# EasyEDA Pro project PCB板文件.epro

# Schematic Schematic1
Create Date: 2025-05-07; Page Name: P1; Project Name: led工程; Schematic Name: Schematic1; Update Date: 2025-05-21; Company: 嘉立创EDA; Page Size: A4; Version: V1.0
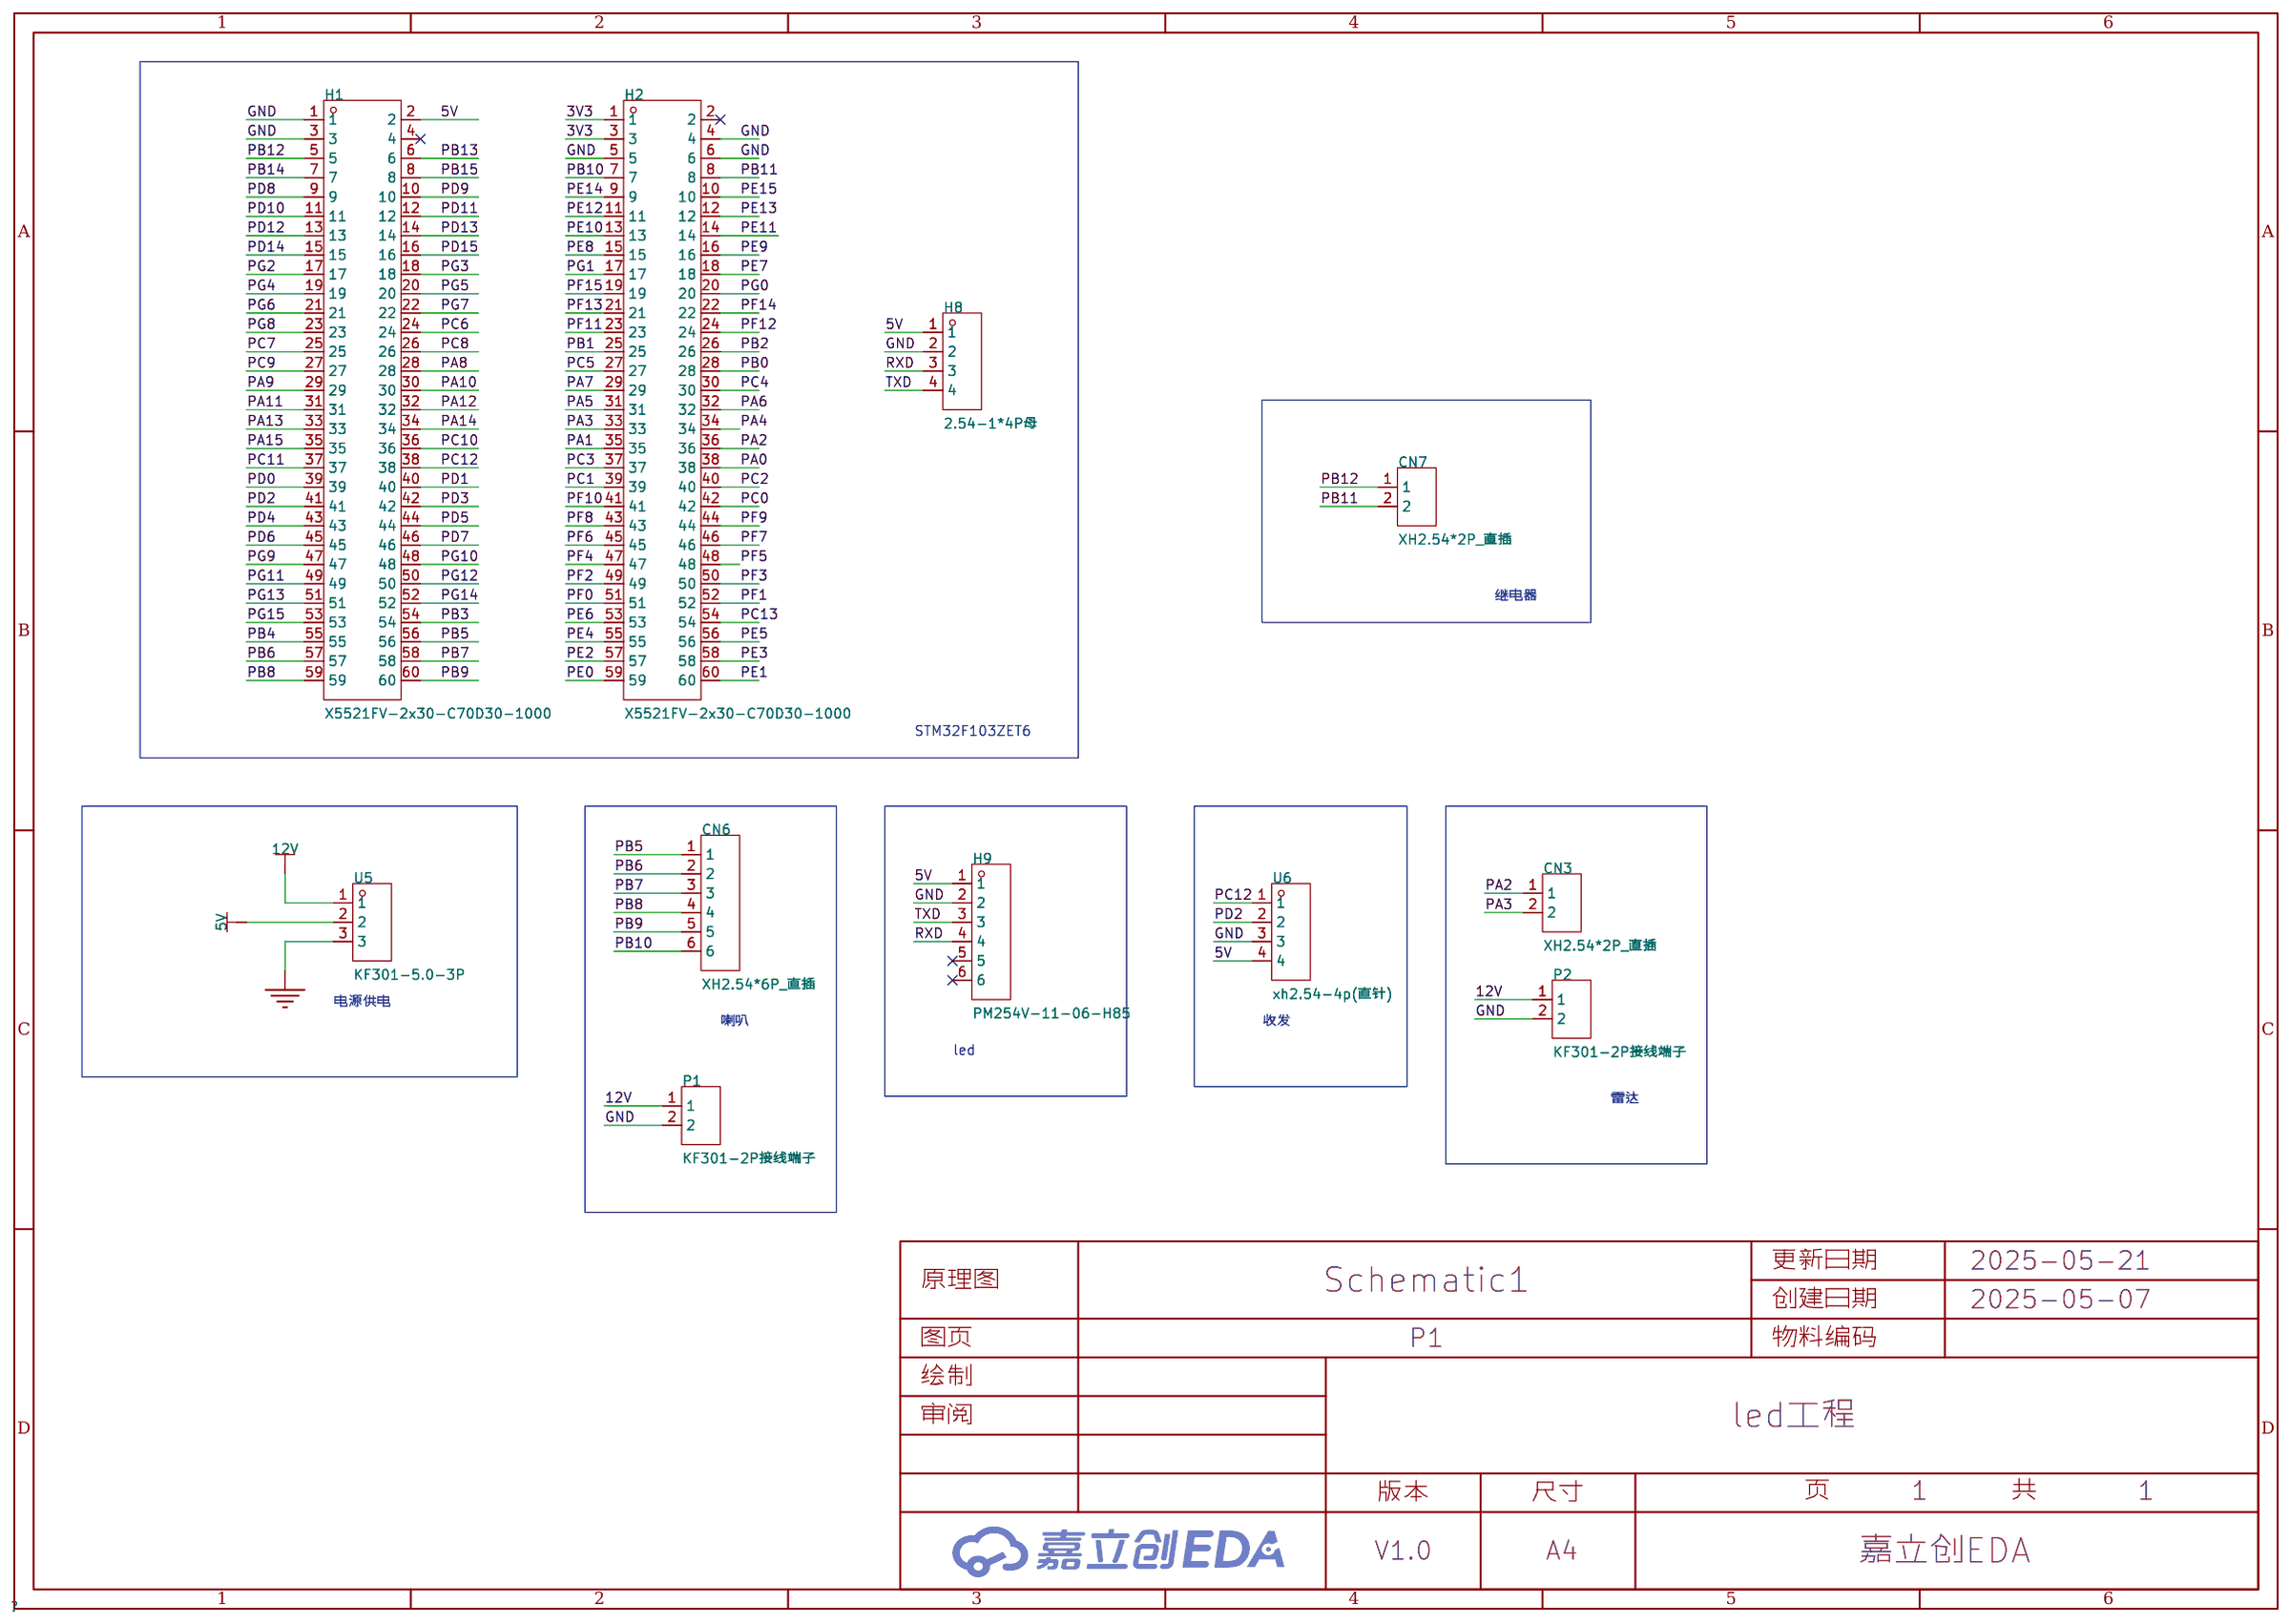
[diagram p0: schematic sheet]

## Parts
CN3  XH2.54*2P_直插  [CONN-TH_2P-P2.50-XH2.54-2P]
CN6  XH2.54*6P_直插  [CONN-TH_XH2.54-6P]
CN7  XH2.54*2P_直插  [CONN-TH_2P-P2.50-XH2.54-2P]
H1  X5521FV-2x30-C70D30-1000  [HDR-TH_60P-P2.54-V-F-R2-C30-S2.54-3]
H2  X5521FV-2x30-C70D30-1000  [HDR-TH_60P-P2.54-V-F-R2-C30-S2.54-3]
H8  2.54-1*4P母  [HDR-TH_4P-P2.54-V-F]
H9  PM254V-11-06-H85  [HDR-TH_6P-P2.54-V-F]
P1  KF301-2P接线端子  [CONN-TH_XY301V-A-5.0-2P]
P2  KF301-2P接线端子  [CONN-TH_XY301V-A-5.0-2P]
U5  KF301-5.0-3P  [CONN-TH_3P-P5.00_KF301-5.0-3P]
U6  xh2.54-4p(直针)  [CONN-TH_4P-P2.50-XH2.54-4P]

## Library data of the parts
CN3 CN7 = XH2.54*2P_直插: Supplier Part: C9900008615; Supplier Footprint: XH2.54_2P; JLCPCB Part Class: 扩展库; Supplier: LCSC
CN6 = XH2.54*6P_直插: Supplier Part: C9900008614; Supplier Footprint: XH2.54_6P; JLCPCB Part Class: 扩展库; Supplier: LCSC
H1 H2 = X5521FV-2x30-C70D30-1000: 插孔结构:2x30P;间距:2.54mm;行距:2.54mm;圆孔/方孔:圆孔;安装类型:直插;排数:双排;总孔位数:60P;额定电流:3A;额定电压:-;插孔方向:顶部;塑高:7mm;触头材质:黄铜;触头镀层:金;工作温度范围:-40℃~+105℃;焊接温度(最大值):260℃;; LCSC Part Name: 间距:2.54mm 2x30P 直插; Supplier Part: C2682214; Manufacturer: XKB Connectivity(中国星坤); Supplier Footprint: 插件,P=2.54mm; Datasheet: https://atta.szlcsc.com/upload/public/pdf/source/20210108/C2682197_06F7869BD6CE28D3571C9D5993C38392.pdf; Supplier: LCSC; Holes Structure: 2x30P; Pitch: 2.54mm; Row Spacing: 2.54mm; Circular Hole / Square Hole: 圆孔; Mounting Type: 直插; Number of Rows: 双排; Number of Holes: 60P; Current Rating (Max): 3A; Holes Direction: 顶部; Insulation Height: 7mm; Contact Material: 黄铜; Contact Plating: 金; Operating Temperature Range: -40℃~+105℃; Soldering Temperature(Max): 260℃
H8 = 2.54-1*4P母: 插孔结构:1x4P;间距:2.54mm;行距:-;圆孔/方孔:方孔;安装类型:直插;排数:单排;总孔位数:4P;额定电流:3A;额定电压:-;插孔方向:顶部;塑高:-;触头材质:青铜;触头镀层:-;工作温度范围:-40℃~+105℃;焊接温度(最大值):-;; LCSC Part Name: 间距:2.54mm 1x4P 直插; Supplier Part: C2718488; Manufacturer: BOOMELE(博穆精密); Supplier Footprint: 插件,P=2.54mm; JLCPCB Part Class: 扩展库; Datasheet: https://atta.szlcsc.com/upload/public/pdf/source/20210301/C2718488_F4427B881E42CAA8DDB0B1C12B3A522C.pdf; Supplier: LCSC; Holes Structure: 1x4P; Pitch: 2.54mm; Circular Hole / Square Hole: 方孔; Mounting Type: 直插; Number of Rows: 单排; Number of Holes: 4P; Current Rating (Max): 3A; Holes Direction: 顶部; Contact Material: 青铜; Operating Temperature Range: -40℃~+105℃
H9 = PM254V-11-06-H85: 插孔结构:1x6P;间距:2.54mm;行距:-;圆孔/方孔:方孔;安装类型:直插;排数:单排;总孔位数:6P;额定电流:3A;额定电压:250V;插孔方向:顶部;塑高:-;工作温度范围:-40℃~+105℃;; LCSC Part Name: 间距:2.54mm 1x6P 直插; Supplier Part: C2832269; Manufacturer: XFCN(兴飞); Supplier Footprint: 插件,P=2.54mm; JLCPCB Part Class: 扩展库; Datasheet: https://atta.szlcsc.com/upload/public/pdf/source/20210514/C2832269_B3EC97736B37C2783BDCE3050AA57447.pdf; Supplier: LCSC; Holes Structure: 1x6P; Pitch: 2.54mm; Circular Hole / Square Hole: 方孔; Mounting Type: 直插; Number of Rows: 单排; Number of Holes: 6P; Current Rating (Max): 3A; Voltage Rating (Max): 250V; Holes Direction: 顶部; Operating Temperature Range: -40℃~+105℃
P1 P2 = KF301-2P接线端子: Supplier Part: C9900016950; Supplier Footprint: CK301-2P; JLCPCB Part Class: 扩展库; Supplier: LCSC
U5 = KF301-5.0-3P: 结构:1x3P;间距:5mm;颜色:蓝色;安装方式:直插;额定电流:17A;额定电压:250V;排数:1;线规 - AWG:14~22;线规 - 平方毫米:1.5;每排PIN数:3;工作温度范围:-30℃~+120℃;; LCSC Part Name: 5mm 1x3P 排数:1 每排P数:3 直插; Supplier Part: C474882; Manufacturer: KEFA(科发); Supplier Footprint: 插件,P=5mm; JLCPCB Part Class: 扩展库; Datasheet: https://atta.szlcsc.com/upload/public/pdf/source/20230317/03A5B5FC229D6F9225E8F51DA1A4E80A.pdf; Supplier: LCSC; Structure: 1x3P; Pitch: 5mm; Color: 蓝色; Mounting Style: 直插; Current Rating (Max): 17A; Voltage Rating (Max): 250V; Number of Pins: 3P; Number of Rows: 1; Wire Gauge - AWG: 14~22; Wire Gauge - mm2: 1.5; Number of PINs Per Row: 3; Operating Temperature Range: -30℃~+120℃
U6 = xh2.54-4p(直针): Supplier Part: C9900015350; JLCPCB Part Class: 扩展库; Supplier: LCSC

## Nets
3V3: H2.1 H2.3
5V: H1.2 H8.1 H9.1 U5.2 U6.4
12V: P1.1 P2.1 U5.1
GND: H1.1 H1.3 H2.4 H2.5 H2.6 H8.2 H9.2 P1.2 P2.2 U5.3 U6.3
PA0: H2.38
PA1: H2.35
PA2: CN3.1 H2.36
PA3: CN3.2 H2.33
PA4: H2.34
PA5: H2.31
PA6: H2.32
PA7: H2.29
PA8: H1.28
PA9: H1.29
PA10: H1.30
PA11: H1.31
PA12: H1.32
PA13: H1.33
PA14: H1.34
PA15: H1.35
PB0: H2.28
PB1: H2.25
PB2: H2.26
PB3: H1.54
PB4: H1.55
PB5: CN6.1 H1.56
PB6: CN6.2 H1.57
PB7: CN6.3 H1.58
PB8: CN6.4 H1.59
PB9: CN6.5 H1.60
PB10: CN6.6 H2.7
PB11: CN7.2 H2.8
PB12: CN7.1 H1.5
PB13: H1.6
PB14: H1.7
PB15: H1.8
PC0: H2.42
PC1: H2.39
PC2: H2.40
PC3: H2.37
PC4: H2.30
PC5: H2.27
PC6: H1.24
PC7: H1.25
PC8: H1.26
PC9: H1.27
PC10: H1.36
PC11: H1.37
PC12: H1.38 U6.1
PC13: H2.54
PD0: H1.39
PD1: H1.40
PD2: H1.41 U6.2
PD3: H1.42
PD4: H1.43
PD5: H1.44
PD6: H1.45
PD7: H1.46
PD8: H1.9
PD9: H1.10
PD10: H1.11
PD11: H1.12
PD12: H1.13
PD13: H1.14
PD14: H1.15
PD15: H1.16
PE0: H2.59
PE1: H2.60
PE2: H2.57
PE3: H2.58
PE4: H2.55
PE5: H2.56
PE6: H2.53
PE7: H2.18
PE8: H2.15
PE9: H2.16
PE10: H2.13
PE11: H2.14
PE12: H2.11
PE13: H2.12
PE14: H2.9
PE15: H2.10
PF0: H2.51
PF1: H2.52
PF2: H2.49
PF3: H2.50
PF4: H2.47
PF5: H2.48
PF6: H2.45
PF7: H2.46
PF8: H2.43
PF9: H2.44
PF10: H2.41
PF11: H2.23
PF12: H2.24
PF13: H2.21
PF14: H2.22
PF15: H2.19
PG0: H2.20
PG1: H2.17
PG2: H1.17
PG3: H1.18
PG4: H1.19
PG5: H1.20
PG6: H1.21
PG7: H1.22
PG8: H1.23
PG9: H1.47
PG10: H1.48
PG11: H1.49
PG12: H1.50
PG13: H1.51
PG14: H1.52
PG15: H1.53
RXD: H8.3 H9.4
TXD: H8.4 H9.3

Not connected (* = marked no-connect by the designer): H1 4*; H2 2*; H9 5* 6*

## Notes on the sheet
- 继电器
- STM32F103ZET6
- 电源供电
- 喇叭
- 收发
- led
- 雷达

# Board PCB1
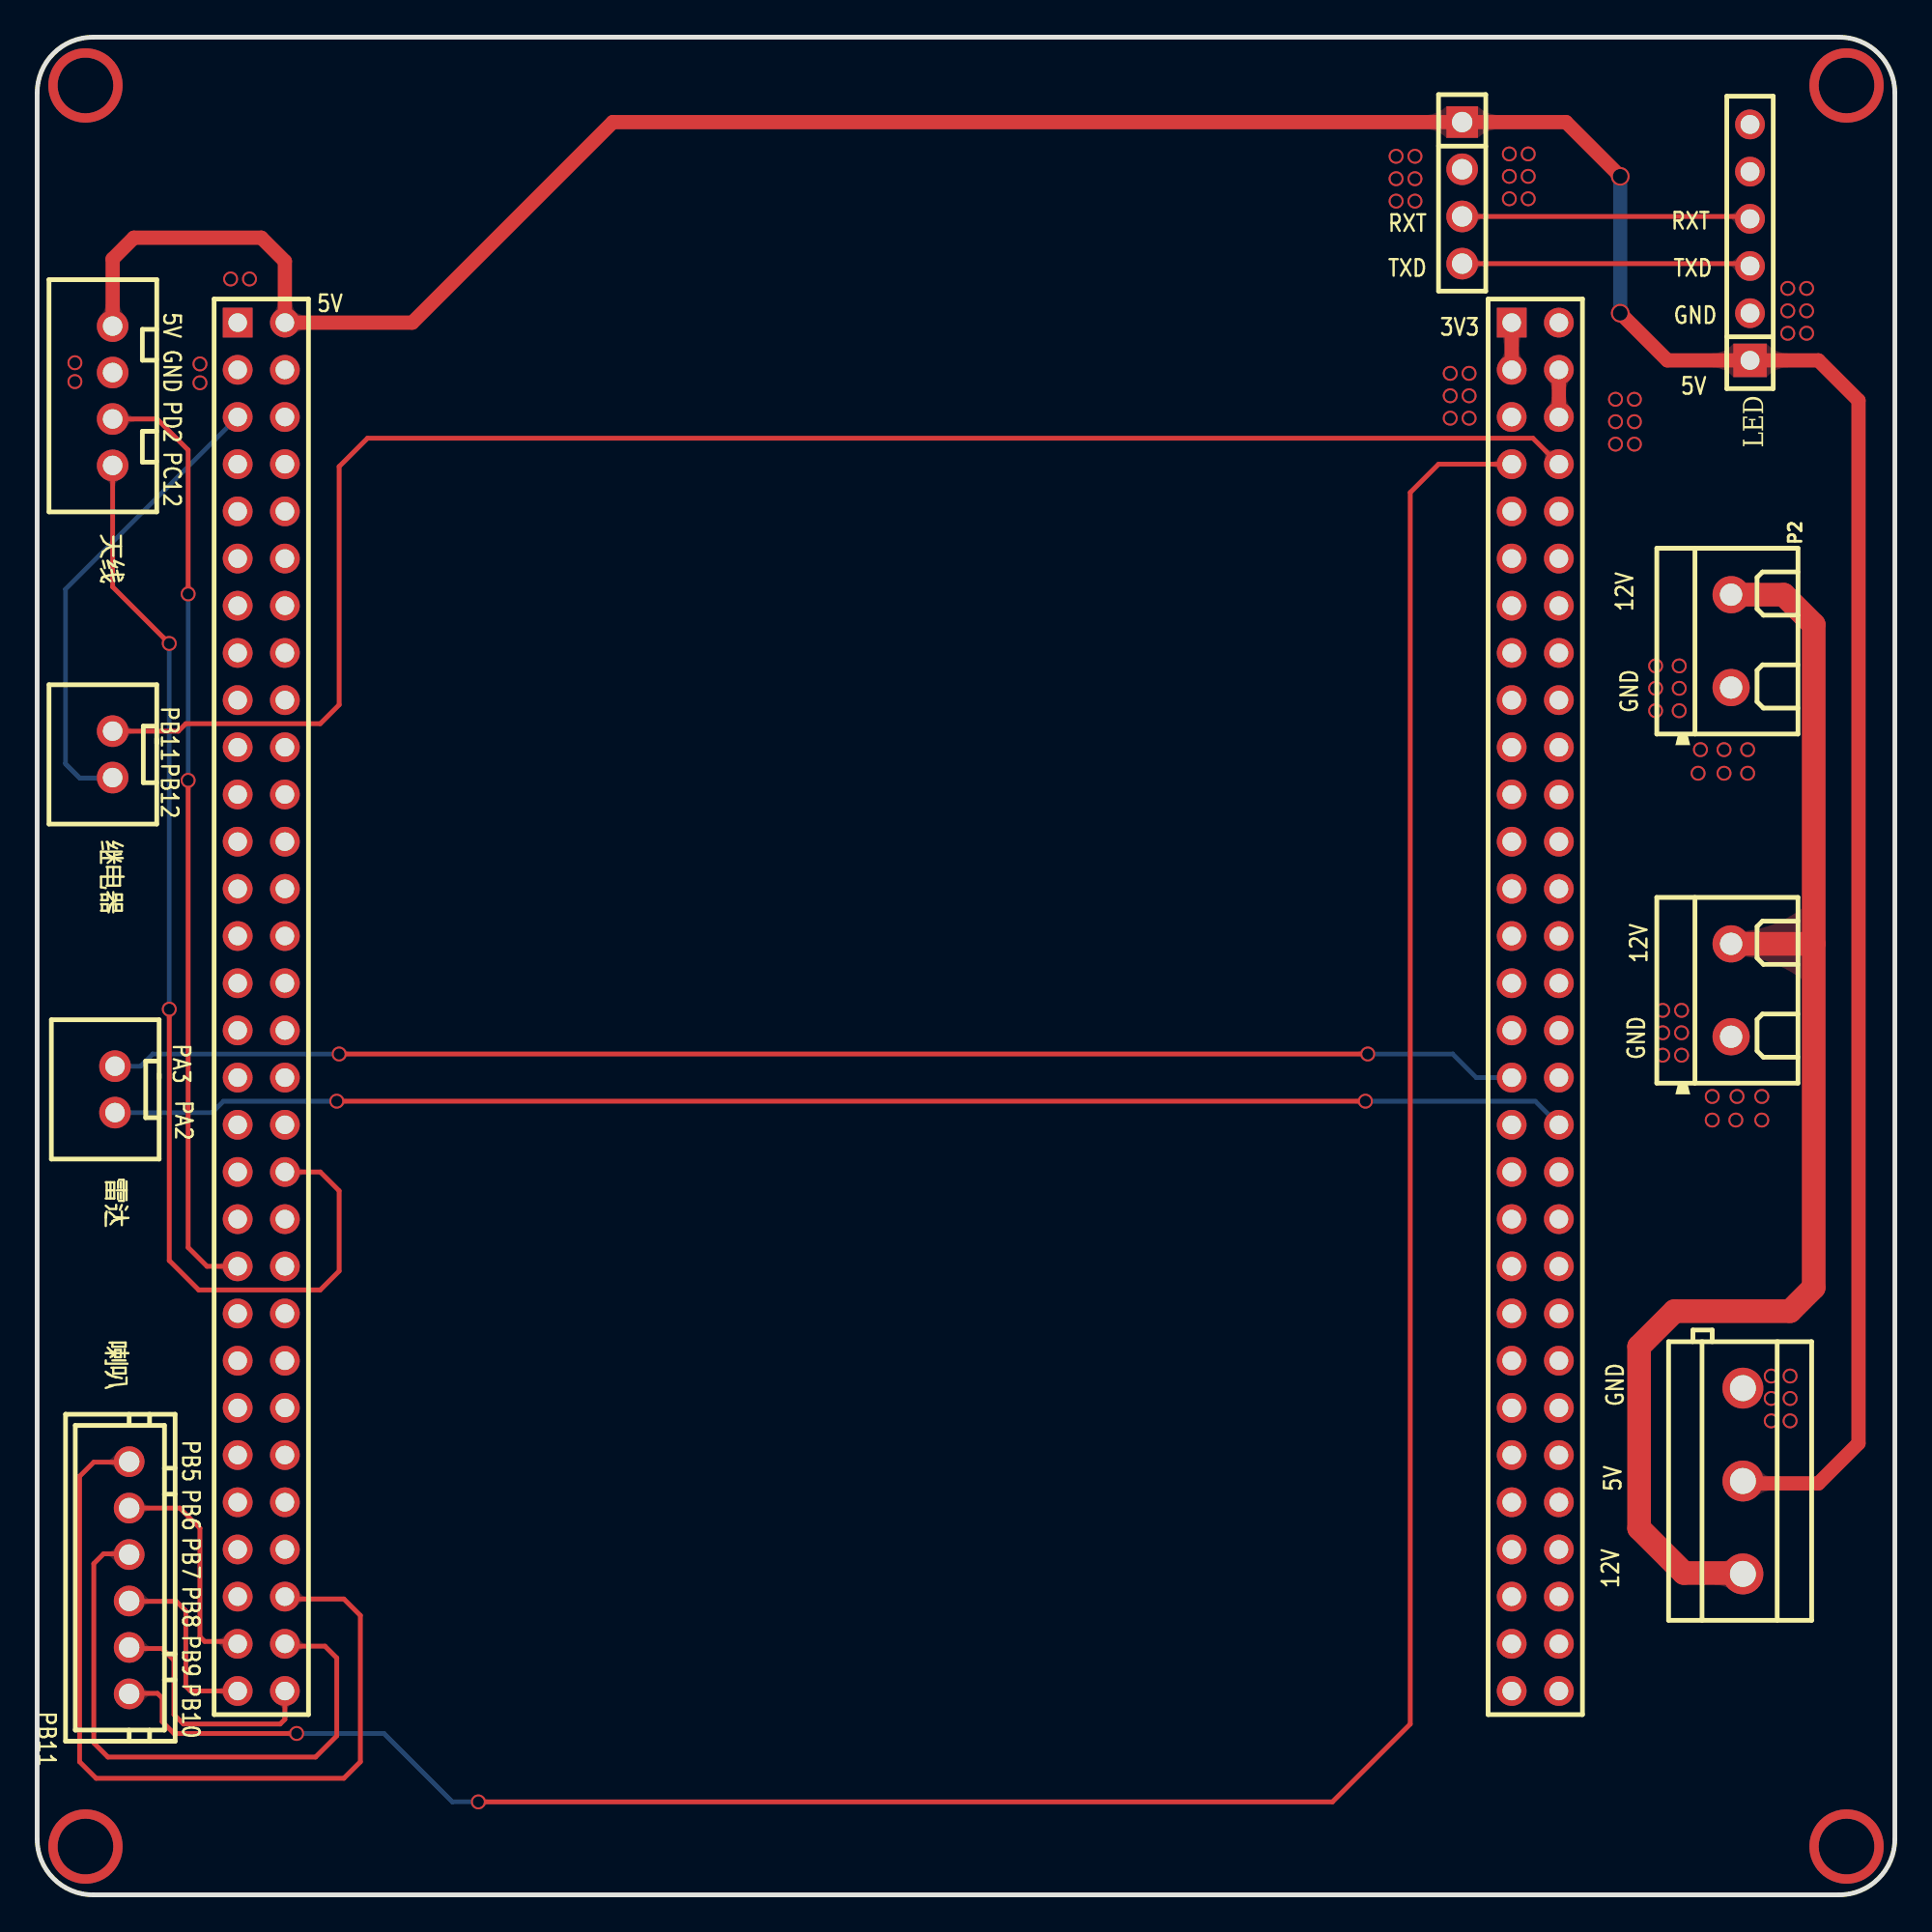
[diagram p1: board, top side]
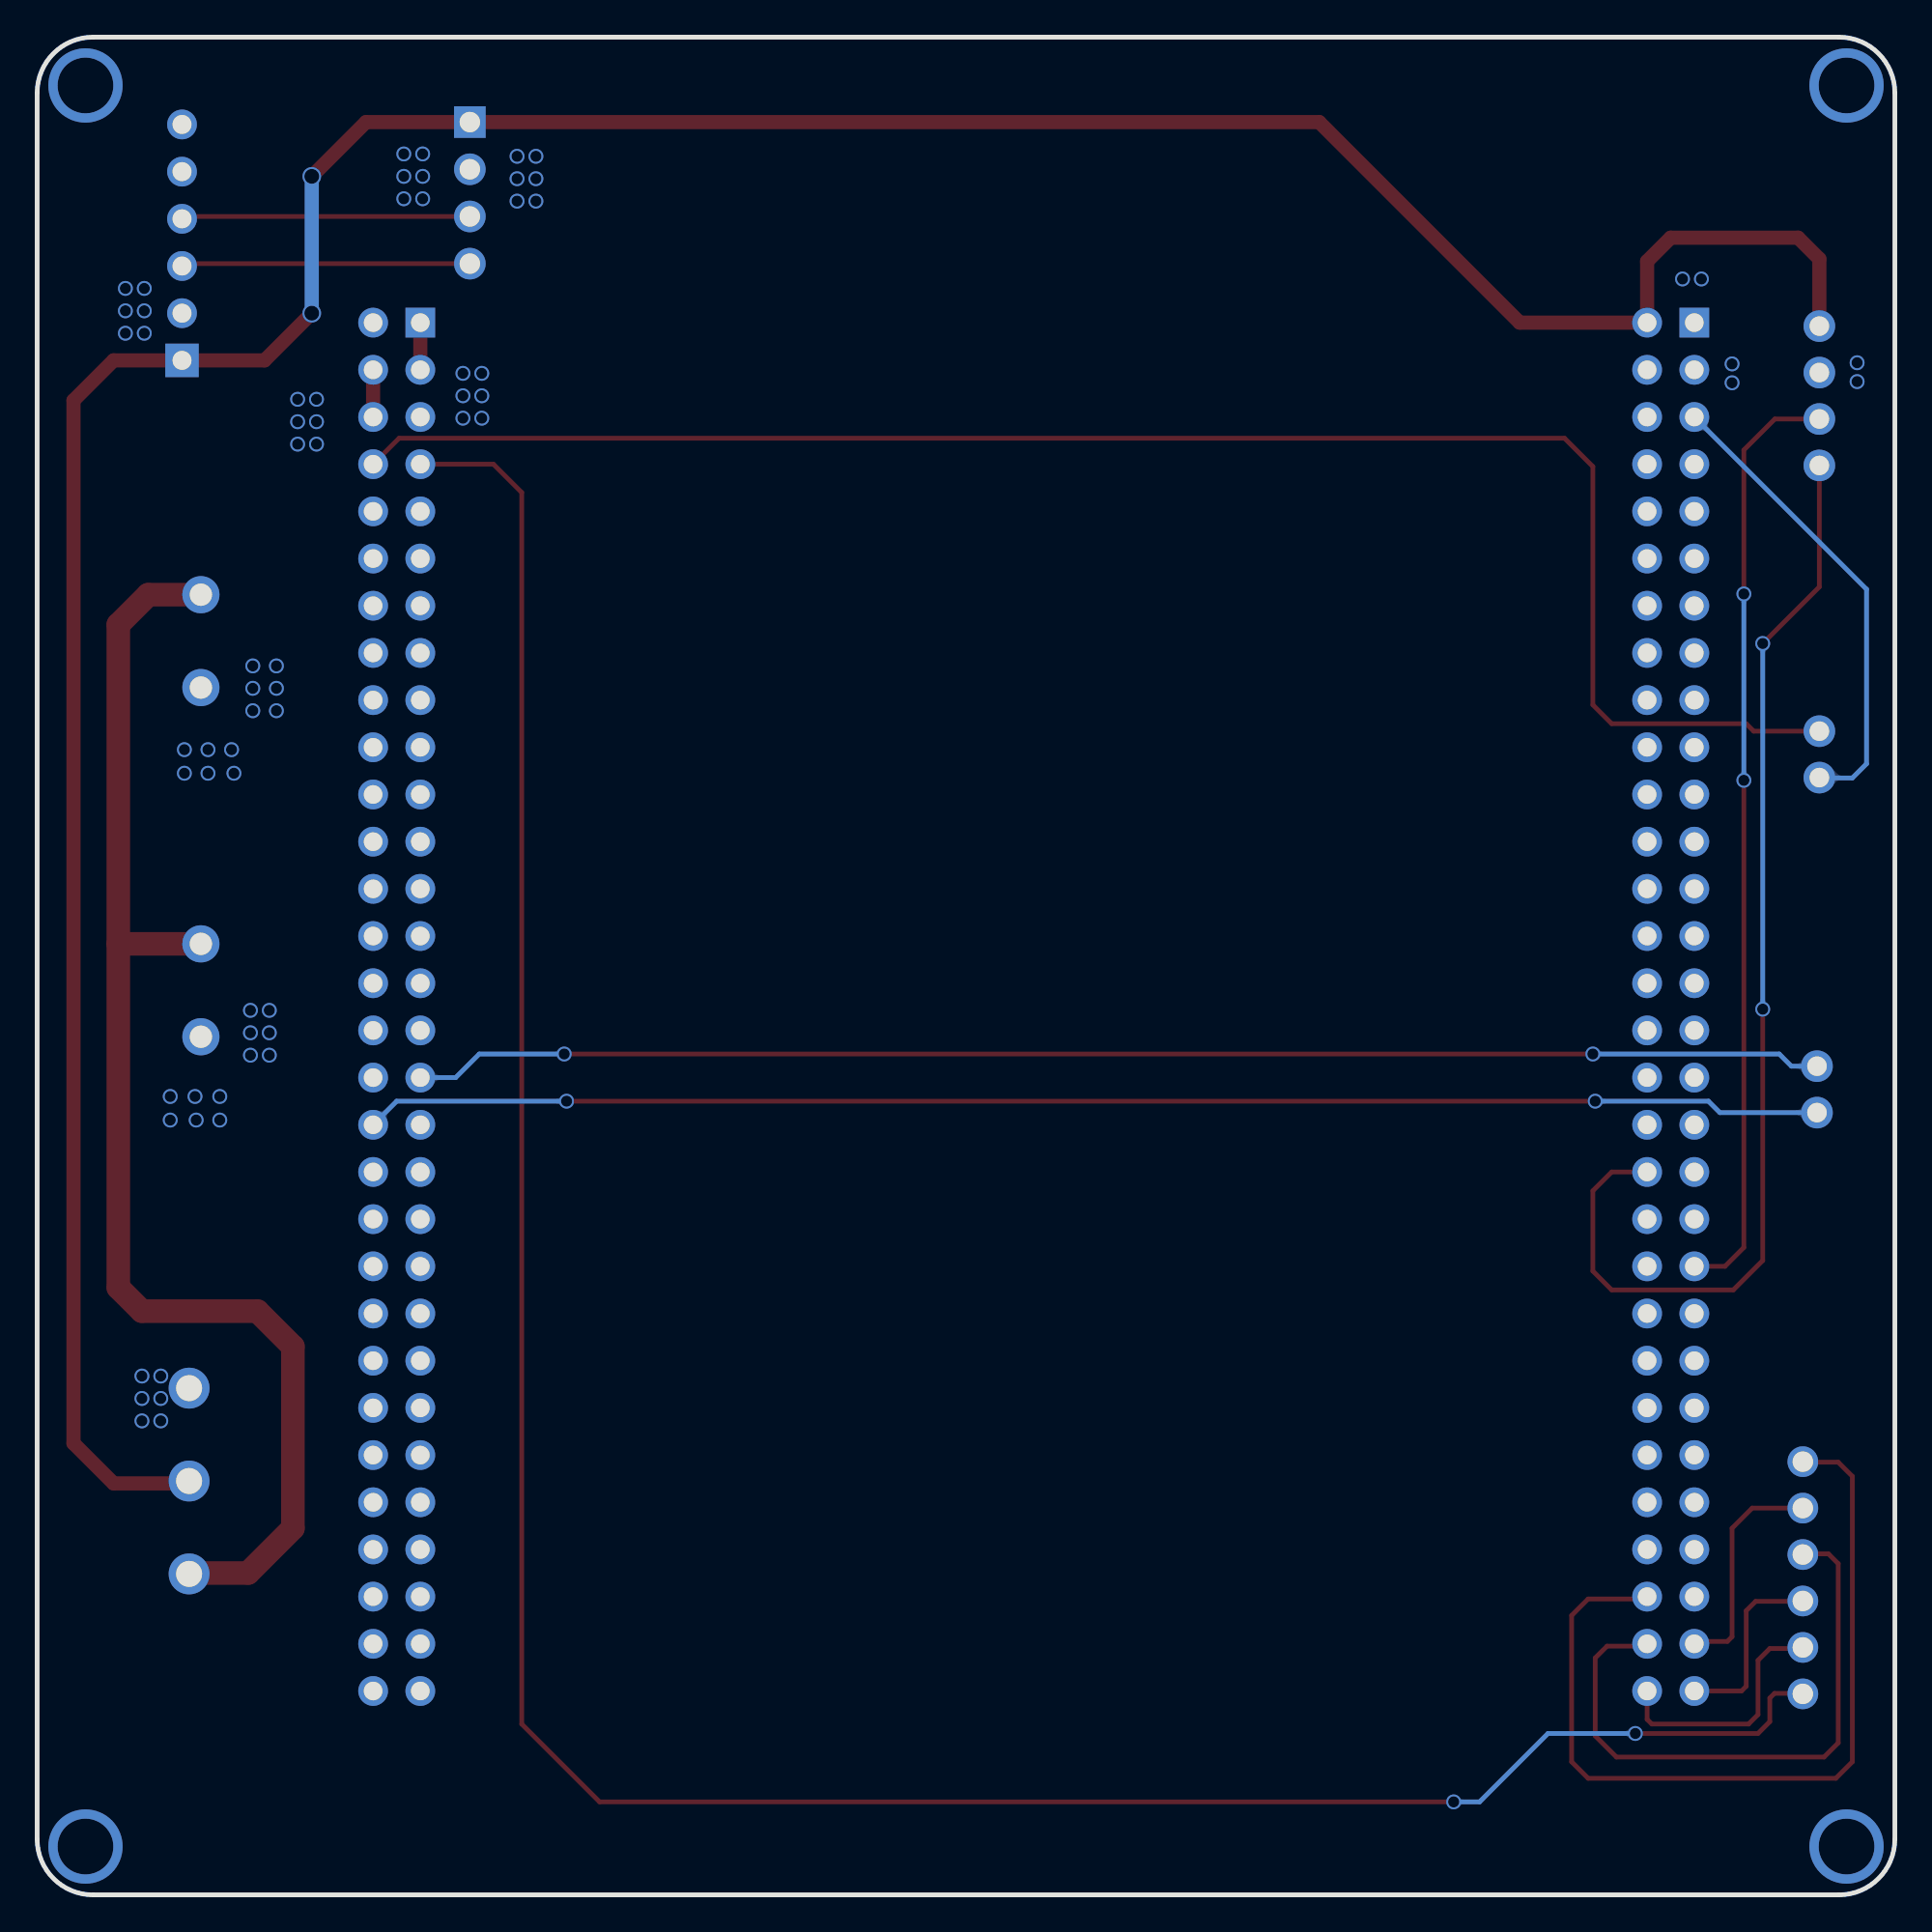
[diagram p2: board, bottom side, seen from below]

Outline 100 x 100 mm; copper layers: Top Layer, Bottom Layer. Coordinates in mm from the lower left corner of the outline.
Outline path: 0,97 0,3 arc(0.88,0.88) 3,0 97,0 arc(99.12,0.88) 100,3 100,97 arc(99.12,99.12) 97,100 3,100 arc(0.88,99.12) 0,97
Stack: Top Layer 0.035mm / Dielectric1 1.51mm FR4 er 4.5 / Bottom Layer 0.035mm

## Design rules (mm)
template: JLCPCB Capability(Two Layers Board)
spacing copperThickness1oz (default): track to track 0.102, other pairs 0.152 to 0.3
spacing copperThickness2oz: track to track 0.203, other pairs 0.152 to 0.3
track width copperThickness1oz (default): min 0.127, default 0.254, max 2.54
track width copperThickness2oz: min 0.203, default 0.254, max 2.54
differential pair differentialPair (default): width min 0.127, default 0.254, max 2.54; gap min 0.152, default 0.152
via viaSize (default): diameter min 0.5, default 0.61, max 10; hole min 0.3, default 0.305, max 6.3

## Placement (name value [footprint] x y rotation side)
CN3  XH2.54*2P_直插  [CONN-TH_2P-P2.50-XH2.54-2P]  4.19 43.36 270 top
CN6  XH2.54*6P_直插  [CONN-TH_XH2.54-6P]  4.95 17.07 270 top
CN7  XH2.54*2P_直插  [CONN-TH_2P-P2.50-XH2.54-2P]  4.06 61.39 270 top
H1  X5521FV-2x30-C70D30-1000  [HDR-TH_60P-P2.54-V-F-R2-C30-S2.54-3]  12.06 47.8 270 top
H2  X5521FV-2x30-C70D30-1000  [HDR-TH_60P-P2.54-V-F-R2-C30-S2.54-3]  80.65 47.8 270 top
H8  2.54-1*4P母  [HDR-TH_4P-P2.54-V-F]  76.71 91.62 270 top
H9  PM254V-11-06-H85  [HDR-TH_6P-P2.54-V-F]  92.2 88.95 90 top
P1  KF301-2P接线端子  [CONN-TH_XY301V-A-5.0-2P]  91.19 48.69 270 top
P2  KF301-2P接线端子  [CONN-TH_XY301V-A-5.0-2P]  91.19 67.49 270 top
U5  KF301-5.0-3P  [CONN-TH_3P-P5.00_KF301-5.0-3P]  91.82 22.28 90 top
U6  xh2.54-4p(直针)  [CONN-TH_4P-P2.50-XH2.54-4P]  4.06 80.7 270 top

## Footprints (pads in the part's own frame, mm; a bottom-side part is the same pattern mirrored in y, then rotated)
CONN-TH_2P-P2.50-XH2.54-2P
  round 1.7 hole 1.05: 1(1.25,0) 2(-1.25,0)
CONN-TH_3P-P5.00_KF301-5.0-3P
  round 2.2 hole 1.4: 1(-5,0) 2(0,0) 3(5,0)
CONN-TH_4P-P2.50-XH2.54-4P
  round 1.7 hole 1.05: 1(3.75,0) 2(1.25,0) 3(-1.25,0) 4(-3.75,0)
CONN-TH_XH2.54-6P
  round 1.65 hole 1.1: 1(-6.25,0) 2(-3.75,0) 3(-1.25,0) 4(1.25,0) 5(3.75,0) 6(6.25,0)
CONN-TH_XY301V-A-5.0-2P
  round 2 hole 1.2: 1(-2.5,0) 2(2.5,0)
HDR-TH_4P-P2.54-V-F
  rect 1.7x1.7 hole 1.1: 1(-3.81,0)
  round 1.7 hole 1.1: 2(-1.27,0) 3(1.27,0) 4(3.81,0)
HDR-TH_6P-P2.54-V-F
  rect 1.8x1.8 hole 1.02: 1(-6.35,0)
  round 1.6 hole 1.02: 2(-3.81,0) 3(-1.27,0) 4(1.27,0) 5(3.81,0) 6(6.35,0)
HDR-TH_60P-P2.54-V-F-R2-C30-S2.54-3
  rect 1.6x1.6 hole 1: 1(-36.83,-1.27)
  round 1.6 hole 1: 2(-36.83,1.27) 3(-34.29,-1.27) 4(-34.29,1.27) 5(-31.75,-1.27) 6(-31.75,1.27) 7(-29.21,-1.27) 8(-29.21,1.27) 9(-26.67,-1.27) 10(-26.67,1.27) 11(-24.13,-1.27) 12(-24.13,1.27) 13(-21.59,-1.27) 14(-21.59,1.27) 15(-19.05,-1.27) 16(-19.05,1.27) 17(-16.51,-1.27) 18(-16.51,1.27) 19(-13.97,-1.27) 20(-13.97,1.27) 21(-11.43,-1.27) 22(-11.43,1.27) 23(-8.89,-1.27) 24(-8.89,1.27) 25(-6.35,-1.27) 26(-6.35,1.27) 27(-3.81,-1.27) 28(-3.81,1.27) 29(-1.27,-1.27) 30(-1.27,1.27) 31(1.27,-1.27) 32(1.27,1.27) 33(3.81,-1.27) 34(3.81,1.27) 35(6.35,-1.27) 36(6.35,1.27) 37(8.89,-1.27) 38(8.89,1.27) 39(11.43,-1.27) 40(11.43,1.27) 41(13.97,-1.27) 42(13.97,1.27) 43(16.51,-1.27) 44(16.51,1.27) 45(19.05,-1.27) 46(19.05,1.27) 47(21.59,-1.27) 48(21.59,1.27) 49(24.13,-1.27) 50(24.13,1.27) 51(26.67,-1.27) 52(26.67,1.27) 53(29.21,-1.27) 54(29.21,1.27) 55(31.75,-1.27) 56(31.75,1.27) 57(34.29,-1.27) 58(34.29,1.27) 59(36.83,-1.27) 60(36.83,1.27)

## Nets
As in the schematic.

Pads without a net: H1 4; H2 2; H9 5 6

## Via types
v1: diameter 4, hole 3, Top Layer to Bottom Layer, 4 vias
v2: diameter 0.8, hole 0.6, Top Layer to Bottom Layer, 76 vias
v3: diameter 1, hole 0.8, Top Layer to Bottom Layer, 2 vias

## Routing (per net, layer and track width the routed paths; a pad name or vN(x,y) marks a point on that pad's centre or on a via; arc(x,y) is an arc through that point)
3V3: length 2.5
  Top Layer w0.762: H2.1 H2.3
5V: length 180.4
  Top Layer w0.762: 91.57,22.15 95.88,22.15 98.04,24.31 98.04,80.44 95.88,82.6 H9.1 87.76,82.6 v3(85.22,85.14) ; U6.4 4.06,88.06 5.21,89.2 12.06,89.2 13.33,87.94 H1.2 20.19,84.63 30.99,95.43 H8.1 82.3,95.43 v3(85.22,92.51)
  Bottom Layer w0.762: v3(85.22,85.14) v3(85.22,92.51)
12V: length 72.1
  Top Layer w1.27: 95.63,51.19 95.63,68.38 94.02,69.99 P2.1 ; 95.63,51.19 P1.1 ; 95.63,51.19 95.63,32.69 94.36,31.42 88.14,31.42 86.23,29.51 86.23,19.74 88.65,17.32 91.39,17.32 91.57,17.15
GND: length 2.5
  Top Layer w0.762: H2.4 H2.6
  vias: v2(2.03,82.47) v2(2.03,81.46) v2(8.76,82.41) v2(8.76,81.39) v2(10.41,86.98) v2(11.43,86.98) v2(73.15,93.59) v2(73.15,92.38) v2(73.15,91.17) v2(74.17,93.59) v2(74.17,92.38) v2(74.17,91.17) v2(76.07,81.9) v2(76.07,80.7) v2(76.07,79.49) v2(77.08,81.9) v2(77.08,80.7) v2(77.08,79.49) v2(79.25,93.71) v2(79.25,92.51) v2(79.25,91.3) v2(80.26,93.71) v2(80.26,92.51) v2(80.26,91.3) v2(84.96,80.51) v2(84.96,79.3) v2(84.96,78.09) v2(85.98,80.51) v2(85.98,79.3) v2(85.98,78.09) v2(87.12,66.15) v2(87.12,64.95) v2(87.12,63.74) v2(87.5,47.61) v2(87.5,46.41) v2(87.5,45.2) v2(88.39,66.15) v2(88.39,64.95) v2(88.39,63.74) v2(88.52,47.61) v2(88.52,46.41) v2(88.52,45.2) v2(89.41,60.38) v2(89.53,61.65) v2(90.17,42.98) v2(90.17,41.71) v2(90.81,61.65) v2(90.81,60.38) v2(91.44,41.71) v2(91.5,42.98) v2(92.07,61.65) v2(92.07,60.38) v2(92.84,42.98) v2(92.84,41.71) v2(93.34,27.93) v2(93.34,26.72) v2(93.34,25.51) v2(94.23,86.47) v2(94.23,85.27) v2(94.23,84.06) v2(94.36,27.93) v2(94.36,26.72) v2(94.36,25.51) v2(95.25,86.47) v2(95.25,85.27) v2(95.25,84.06)
(no net):
  vias: v1(2.6,97.4) v1(2.6,2.6) v1(97.4,97.4) v1(97.4,2.6)
PA2: length 78.5
  Top Layer w0.254: v2(16.13,42.72) v2(71.5,42.72)
  Bottom Layer w0.254: v2(71.5,42.72) 80.65,42.72 H2.36 ; v2(16.13,42.72) 10.03,42.72 9.42,42.11 CN3.1
PA3: length 76
  Top Layer w0.254: v2(16.26,45.26) v2(71.63,45.26)
  Bottom Layer w0.254: CN3.2 5.57,44.61 6.22,45.26 v2(16.26,45.26) ; v2(71.63,45.26) 76.2,45.26 77.47,43.99 H2.33
PB5: length 46.2
  Top Layer w0.254: H1.56 13.46,15.93 16.51,15.93 17.4,15.04 17.4,7.16 16.51,6.27 3.17,6.27 2.29,7.16 2.29,22.53 3.05,23.29 4.6,23.29
PB6: length 12.3
  Top Layer w0.254: CN6.2 7.68,20.82 8.76,19.74 8.76,13.89 9.02,13.64 10.67,13.64 H1.57
PB7: length 32.7
  Top Layer w0.254: 4.7,18.36 3.57,18.36 3.05,17.83 3.05,8.18 3.81,7.42 14.99,7.42 16.13,8.56 16.13,12.75 15.49,13.39 13.46,13.39 H1.58
PB8: length 9.8
  Top Layer w0.254: H1.59 8.25,10.97 8,11.23 8,15.29 7.49,15.8 5.33,15.8
PB9: length 13.2
  Top Layer w0.254: 5.21,13.26 6.73,13.26 7.37,12.62 7.37,9.7 7.87,9.19 13.08,9.19 13.33,9.45 H1.60
PB10: length 146.2
  Top Layer w0.254: v2(23.75,5) 69.72,5 73.91,9.19 73.91,75.49 75.44,77.01 H2.7 ; v2(13.97,8.69) 7.37,8.69 6.73,9.32 6.73,10.59 6.48,10.85 5.21,10.85 5.08,10.72
  Bottom Layer w0.254: v2(13.97,8.69) 18.67,8.69 22.35,5 v2(23.75,5)
PB11: length 92.5
  Top Layer w0.254: CN7.2 7.6,62.64 8,63.04 15.24,63.04 16.26,64.06 16.26,76.89 17.78,78.41 80.52,78.41 H2.8
PB12: length 25.4
  Bottom Layer w0.254: H1.5 1.52,70.28 1.52,60.88 2.29,60.12 4.04,60.12 CN7.1
PC12: length 61.9
  Top Layer w0.254: H1.38 15.24,38.91 16.26,37.9 16.26,33.58 15.24,32.56 8.69,32.56 7.11,34.15 v2(7.11,47.68) ; v2(7.11,67.36) 4.06,70.41 U6.1
  Bottom Layer w0.254: v2(7.11,67.36) v2(7.11,47.68)
PD2: length 50.8
  Top Layer w0.254: v2(8.13,70.03) 8.13,77.78 6.46,79.45 U6.2 ; v2(8.13,60) 8.13,34.85 9.14,33.83 H1.41
  Bottom Layer w0.254: v2(8.13,70.03) v2(8.13,60)
RXD: length 15.5
  Top Layer w0.254: H8.3 92.07,90.35 H9.4
TXD: length 15.5
  Top Layer w0.254: H9.3 92.07,87.81 H8.4

## Copper pours and planes (outline as drawn; the poured copper is in the pictures)
GND on Top Layer: -1.65,100.25 101.6,100.25 101.6,-0.08 -1.65,-0.08
GND on Bottom Layer: -1.52,100.63 103.12,100.63 103.12,-0.84 -1.52,-0.84

Small or netless copper shapes (teardrops, artwork), in the pictures only: 52 on Top Layer, 18 on Bottom Layer

## Text on the board
Top Silkscreen Layer: RXT | TXD | GND | 5V | 12V | PB11 | PB12 | PD2 | PC12 | PA3 | PA2 | PB5 | PB6 | PB7 | PB8 | PB9 | PB10 | 3V3 | 天线 | 继电器 | 喇叭 | LED | 雷达
